# EAGLE schematic 555 (EAGLE 6.5.0)
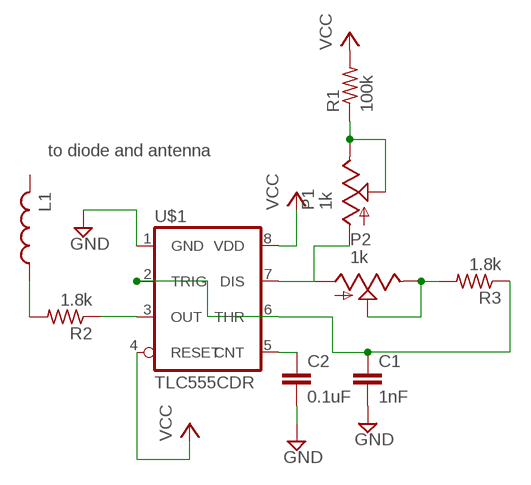
[diagram p0: schematic, sheet 1]

## Parts
C1  1nF  C-EUC0805  [C0805]
C2  0.1uF  C-EUC0805  [C0805]
L1  L-USL2012C  [L2012C]
P1  1k  TRIM_US-3223J  [3223J]
P2  1k  TRIM_US-3223J  [3223J]
R1  100k  R-US_0204/7  [0204/7]
R2  1.8k  R-US_R0805  [R0805]
R3  1.8k  R-US_R0805  [R0805]
U$1  TLC555CDR  [TLC555CRD]

## Nets
GND: C1.2 C2.2 U$1.1(GND)
N$1: P1.1(A) P2.1(A) U$1.7(DIS)
N$2: R2.1 U$1.3(OUT)
N$3: P1.2(S)
N$4: C1.1 R3.1 U$1.2(TRIG) U$1.6(THR)
N$5: P2.2(S) P2.3(E) R3.2
N$6: P1.3(E) R1.1
N$7: C2.1 U$1.5(CNT)
N$8: L1.1 R2.2
VCC: R1.2 U$1.4(RESET) U$1.8(VDD)
Unconnected: L1.2

## Notes on the sheet
- to diode and antenna

## Library data of the parts
C1 C2 = resistor:C-EU: CAPACITOR, European symbol
L1 = resistor:L-US: INDUCTOR, American symbol
P1 P2 = potentiometer:TRIM_US-: POTENTIOMETER
R1-R3 = resistor:R-US_: RESISTOR, American symbol
U$1 = ece510_library:TLC555CDR